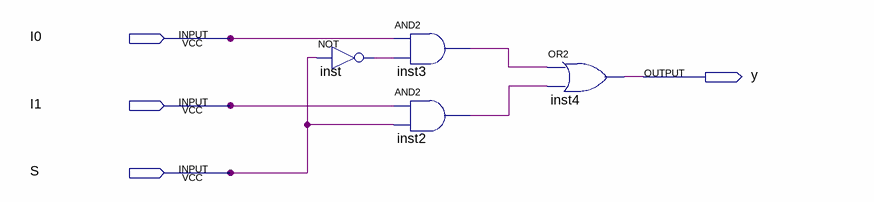
[diagram p0: schematic sheet]
// Quartus schematic Mux21.bdf as structural Verilog: 4 symbols, 4 pins
module Mux21 (
  input  I0,
  input  I1,
  input  S,
  output y
);

  wire inst2_out, inst3_out, inst_out;

  not inst (inst_out, S);
  and inst3 (inst3_out, I0, inst_out);
  and inst2 (inst2_out, I1, S);
  or inst4 (y, inst3_out, inst2_out);
endmodule
